# EAGLE design I2Ciso_module_v10 (EAGLE 7.2.0)
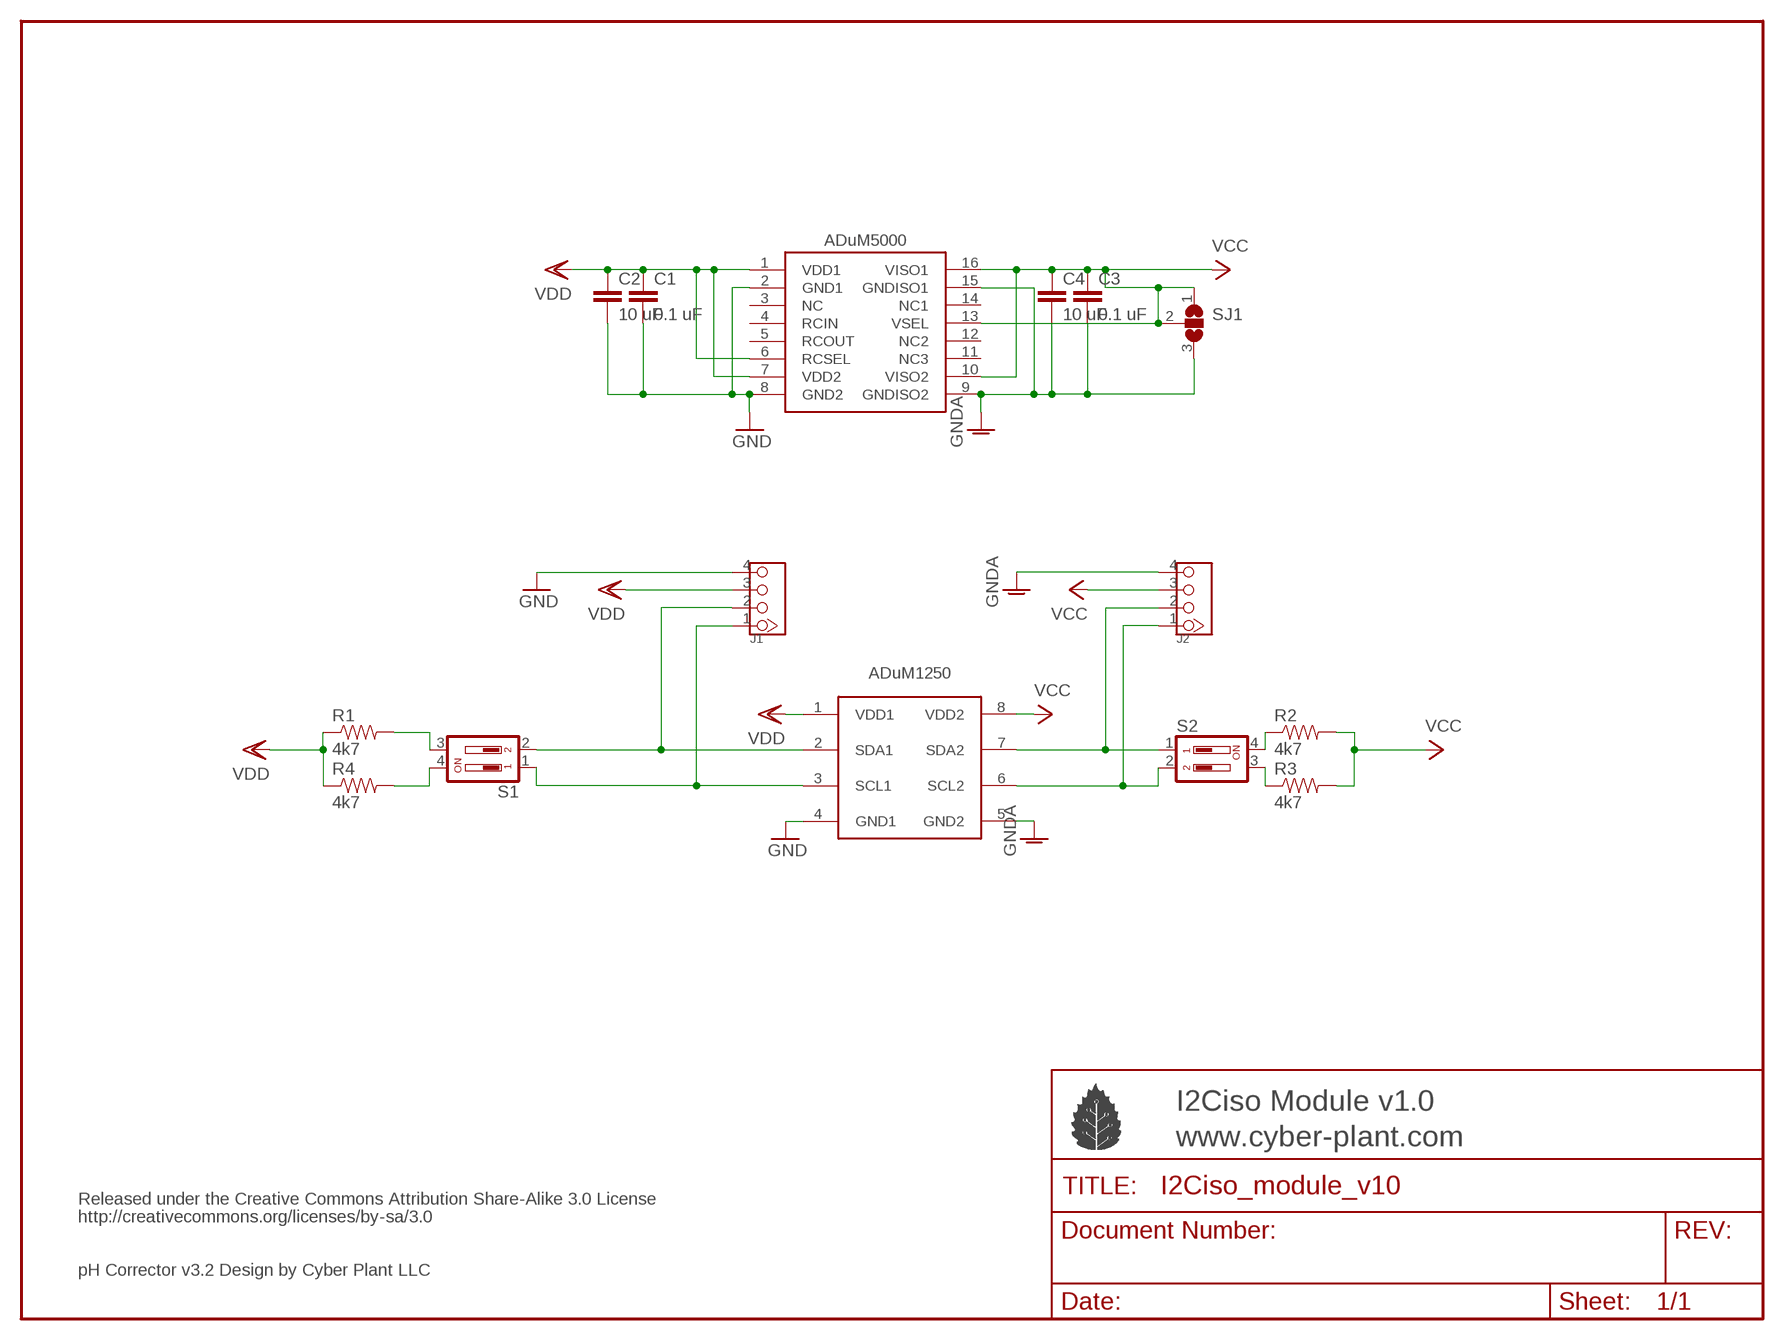
[diagram p0: schematic, sheet 1]

## Parts
C1  0.1 uF  CAP1206  [1206]
C2  10 uF  CAP1206  [1206]
C3  0.1 uF  CAP1206  [1206]
C4  10 uF  CAP1206  [1206]
J1  TWIG-4P-2.090D  [4P-2.0-90D]
J2  TWIG-4P-2.090D  [4P-2.0-90D]
R1  4k7  RESISTOR1206  [1206]
R2  4k7  RESISTOR1206  [1206]
R3  4k7  RESISTOR1206  [1206]
R4  4k7  RESISTOR1206  [1206]
S1  DS02  [DS-02]
S2  DS02  [DS-02]
SJ1  SJ2W  [SJ_2]
U$3  ADUM1251  [SO8]
U$4  ADUM5000  [SO-16W]

## Nets
GND: C1.2 C2.2 J1.4 U$3.4(GND1) U$4.2(GND1) U$4.8(GND2)
GNDA: C3.2 C4.2 J2.4 SJ1.3 U$3.5(GND2) U$4.9(GNDISO2) U$4.15(GNDISO1)
N$3: J1.2 S1.2 U$3.2(SDA1)
N$5: R3.1 S2.3
N$6: J1.1 S1.1 U$3.3(SCL1)
N$9: R2.1 S2.4
N$10: J2.2 S2.1 U$3.7(SDA2)
N$25: J2.1 S2.2 U$3.6(SCL2)
N$30: R1.2 S1.3
N$32: R4.2 S1.4
VDD1: C1.1 C2.1 J1.3 R1.1 R4.1 U$3.1(VDD1) U$4.1(VDD1) U$4.6(RCSEL) U$4.7(VDD2) ; supply symbol labelled VDD
VDD2: C3.1 C4.1 J2.3 R2.2 R3.2 SJ1.1 SJ1.2 U$3.8(VDD2) U$4.10(VISO2) U$4.13(VSEL) U$4.16(VISO1) ; supply symbol labelled VCC
Unconnected: U$4.3(NC) U$4.4(RCIN) U$4.5(RCOUT) U$4.11(NC3) U$4.12(NC2) U$4.14(NC1)

## Notes on the sheet
- I2Ciso Module v1.0
- www.cyber-plant.com
- Released under the Creative Commons Attribution Share-Alike 3.0 License
- http://creativecommons.org/licenses/by-sa/3.0
- pH Corrector v3.2 Design by Cyber Plant LLC

## Library data of the parts
C1-C4 = SparkFun:CAP: Capacitor Standard 0603 ceramic capacitor, and 0.1" leaded capacitor.
J1 J2 = Connector_cp:TWIG-4P-2.0
R1-R4 = SparkFun:RESISTOR: Resistor Basic schematic elements and footprints for 0603, 1206, and PTH resistors.; PROD_ID: RES-00824
S1 S2 = switch-dil:DS02: DIL/CODE SWITCH; OC_FARNELL: 9472126; OC_NEWARK: unknown
SJ1 = jumper:SJ2W: SMD solder JUMPER
U$3 = ADuM1250:ADUM1251
U$4 = ADuM5000:ADUM5000

## Board
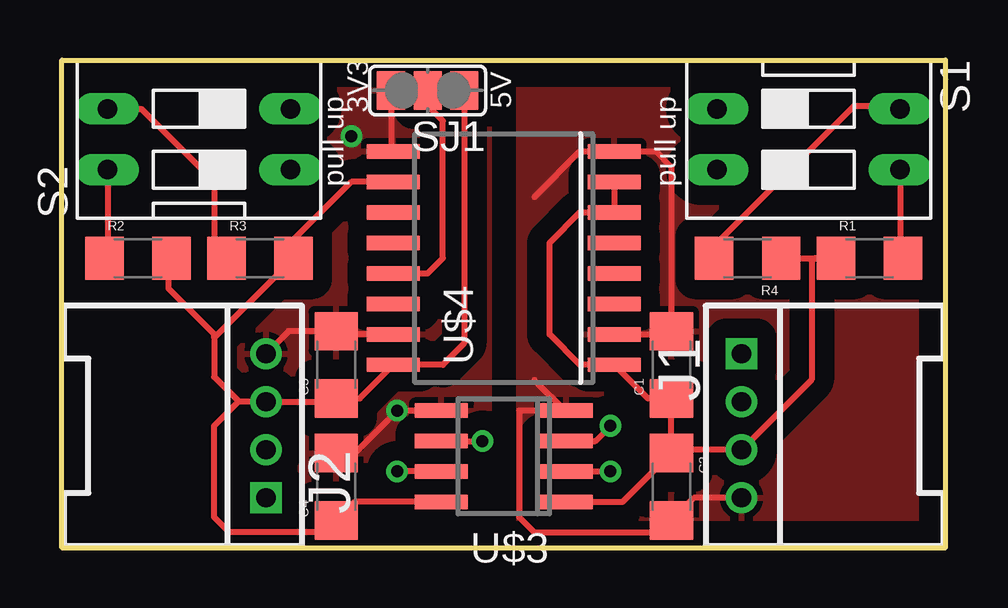
[diagram p1: board, top side]
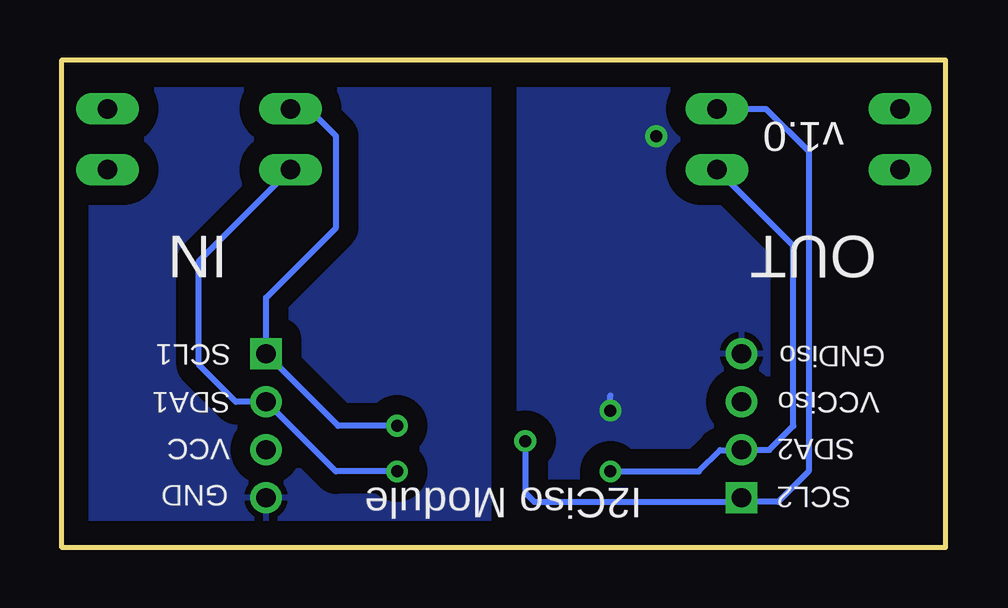
[diagram p2: board, bottom side, seen from below]

Size 36.83 x 20.32 mm. Coordinates in mm from the lower left corner, seen from the top.
Outline: 0,0 36.83,0 36.83,20.32 0,20.32 0,0
Copper layers (1*16): Top 0.035mm / dielectric 1.5mm / Bottom 0.035mm
Design rules "default *": minimum track width 6mil, minimum drill 12mil, track to track 8mil, track to pad 8mil, pad to pad 8mil, via to via 8mil, smd to smd 8mil, copper to edge 40mil, drill to drill 12mil, minimum pad ring 10mil, minimum via ring 8mil, stop-mask expansion 4mil, vias tented up to drill 20mil, thermal gap 10mil

### Footprints (pad centres in the part's own frame; a part is rotated, then mirrored left to right if it is on the bottom)
1206 = smd 1.6 x 1.8: 1 -1.4,0; 2 1.4,0
4P-2.0-90D = drill 0.8 pad 1.27 square: 1 -3,0 | drill 0.8 pad 1.27: 2 -1,0; 3 1,0; 4 3,0
DS-02 = drill 0.813 long: 1 -1.27,-3.81; 2 1.27,-3.81; 3 1.27,3.81; 4 -1.27,3.81
SJ_2 = smd 1.168 x 1.6: 1 -1.524,0; 2 0,0; 3 1.524,0
SO8 = smd 0.6 x 2.2: 1 -1.905,-2.6; 2 -0.635,-2.6; 3 0.635,-2.6; 4 1.905,-2.6; 5 1.905,2.6; 6 0.635,2.6; 7 -0.635,2.6; 8 -1.905,2.6
SO-16W = smd 0.6 x 2.2: 1 -4.445,-4.6; 2 -3.175,-4.6; 3 -1.905,-4.6; 4 -0.635,-4.6; 5 0.635,-4.6; 6 1.905,-4.6; 7 3.175,-4.6; 8 4.445,-4.6; 9 4.445,4.6; 10 3.175,4.6; 11 1.905,4.6; 12 0.635,4.6; 13 -0.635,4.6; 14 -1.905,4.6; 15 -3.175,4.6; 16 -4.445,4.6

### Placement (x,y rotation side)
C1  25.4,7.62 90 top
C2  25.4,2.54 270 top
C3  11.43,7.62 90 top
C4  11.43,2.54 90 top
J1  28.32,5.08 270 top
J2  8.51,5.08 90 top
R1  33.65,12.07 0 top
R2  3.17,12.07 0 top
R3  8.26,12.07 0 top
R4  28.57,12.07 180 top
S1  31.11,17.02 270 top
S2  5.71,17.02 90 top
SJ1  15.24,19.05 180 top
U$3  18.41,3.81 90 top
U$4  18.41,12.07 90 top

### Tracks (layer width: path | path; a pad name or v marks a point on that pad's centre or on a via)
GND
  Top 0.254: 22.86,8.89 U$4.2 25.27,8.89 C1.2 25.4,15.88 24.77,16.51 U$4.8 21.59,16.51 19.69,14.61 | J1.4 26.34,2.08 C2.2 24.89,0.64 19.69,0.64 19.05,1.27 19.05,5.72 U$3.4 21.02,5.66 19.69,6.99
  pour Top (isolate 0.813): 19.05,0 19.05,20.32 36.83,20.32 36.83,0
  pour Bottom (isolate 0.813): 19.05,0 19.05,20.32 36.83,20.32 36.83,0
GNDA  (via drill 0.5)
  Top 0.254: SJ1.3 13.72,16.61 U$4.9 14.6,16.51 | U$4.15 11.56,8.89 C3.2 9.45,9.02 J2.4 | C4.2 12.19,3.94 v13.97,5.72 U$3.5
  Bottom 0.254: v13.97,5.72 13.97,6.35
  other vias: 12.06,17.15
  pour Bottom (isolate 0.813): 0,20.32 17.78,20.32 17.78,0 0,0
  pour Top (isolate 0.813): 0,20.32 17.78,20.32 17.78,0 0,0
N$3  (via drill 0.5)
  Top 0.254: U$3.2 v22.86,3.18
  Bottom 0.254: S1.2 31.11,11.94 31.11,7.62 29.57,6.08 J1.2 25.42,3.18 v22.86,3.18
N$5
  Top 0.254: S2.3 3.3,18.29 6.35,15.24 6.35,11.56 R3.1
N$6  (via drill 0.5)
  Top 0.254: U$3.3 22.23,4.45 v22.86,5.08
  Bottom 0.254: S1.1 27.18,18.41 26.67,18.41 25.4,17.15 25.4,13.34 28.32,10.41 J1.1 25.32,5.08 v22.86,5.08
N$9
  Top 0.254: 1.27,11.56 R2.1 1.9,12.2 S2.4
N$10  (via drill 0.5)
  Top 0.254: U$3.7 v13.97,3.18
  Bottom 0.254: v13.97,3.18 10.29,3.18 9.4,4.06 8.53,4.06 J2.2 7.35,4.08 6.35,5.08 6.35,12.57 S2.1
N$25  (via drill 0.5)
  Top 0.254: U$3.6 v17.53,4.45
  Bottom 0.254: v17.53,4.45 17.53,2.29 17.14,1.91 8.68,1.91 J2.1 8.33,1.91 6.98,1.91 5.71,3.18 5.71,16.51 7.49,18.29 S2.2
N$30
  Top 0.254: 35.56,12.2 R1.2 34.92,12.2 S1.3
N$32
  Top 0.254: S1.4 34.8,18.41 33.02,18.41 27.3,12.7 27.3,12.2 R4.2
VDD1
  Top 0.254: C2.1 25.54,4.08 J1.3 31.24,7 31.24,11.94 31.38,12.07 R1.1 R4.1 | C2.1 C1.1 24.41,6.22 U$4.1 21.59,7.62 20.32,8.89 20.32,12.7 21.59,13.97 U$4.6 U$4.7 | U$3.1 23.37,1.91 C2.1
VDD2
  Top 0.254: U$3.8 12.19,1.91 C4.1 11.3,1.14 10.79,0.64 6.98,0.64 6.35,1.27 6.35,5.08 7.37,6.1 | 7.37,6.1 8.49,6.1 J2.3 11.29,6.08 C3.1 12.42,6.22 U$4.16 15.87,7.62 16.76,8.51 SJ1.1 SJ1.2 15.24,18.41 15.87,17.78 15.87,12.07 15.24,11.43 U$4.13 | 6.35,8.76 6.35,7.12 7.37,6.1 | U$4.10 12.06,15.24 9.53,12.7 9.53,12.2 R3.2 6.35,8.76 | 6.35,8.76 6.35,8.89 4.44,10.8 4.44,11.94 R2.2

### Text on the board
tPlace: 3V3 | 5V | pull up | pull up
bPlace: v1.0 | OUT | IN | GNDiso | SCL1 | VCCiso | SDA1 | SDA2 | VCC | SCL2 | I2Ciso Module | GND
_tsilk: JP5 | JP4 | GND | CN3 | Pump 2 | Pump 1 | TX | RX | BLA / BLK | CN2 | Enable | 16 | D9 / D8 | ISP | CN1 | 1X4-BIG | 10k | R6 | FDS6630A | Q2 | D7 / D6 | 1X4-BIG | Disable | N/A | SCLK / SCK | SDO / MISO | SDI / MOSI | CSB / SS | LCD Module | 1X4-BIG | 1M | R7 | N/A | FDS6630A | Q1 | D5 / GND | 100R for Pt100 | 1K for Pt1000 | 10k | R8 | D4 / GND | R1 | R9 | D1 | D7 | 5V / GND | 1 | 1M | MBRA140 | MBRA140 | JP2 | 10k | CyberPlant | R11 | FSMCD | Pump 1 | RTD2 | pH Corrector Shield v3.0 | S3 | GND | IC1 | 4.3K | R5 | 10k | Vin | LMP2 | R4 | 1.3K | LMP91200_PW_16 | R10 | FSMCD | 680R | 2K | GND | CN6 | R3 | R2 | S1 | 5V | S4 | CN5 | FSMCD | Vin | J1 | GND | CN4 | Pump 2 | BNC | Analog | A1 | A2 | A3 | JP1 | 5V | GND | VIN | JP3 | SDA | SCL | S2 | FSMCD | BNC2